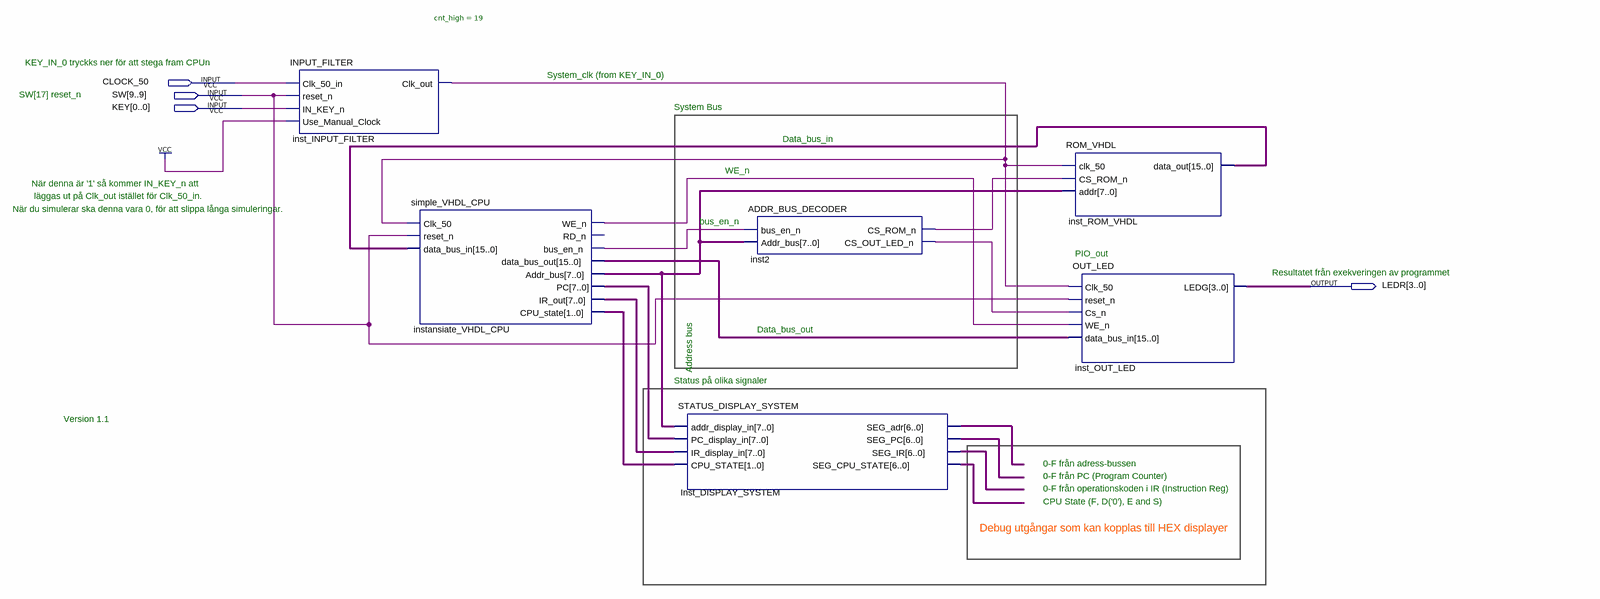
[diagram p0: schematic sheet]
// Quartus schematic CPU_VHDL_projekt.bdf as structural Verilog: 6 symbols, 4 pins
module CPU_VHDL_projekt (
  input  CLOCK_50,
  input  [9:9] SW,
  input  [0:0] KEY,
  output [3:0] LEDR
);

  wire inst2_cs_out_led_n, inst2_cs_rom_n, inst_INPUT_FILTER_clk_out, instansiate_VHDL_CPU_bus_en_n,
       instansiate_VHDL_CPU_we_n;
  wire [1:0] instansiate_VHDL_CPU_cpu_state;
  wire [6:0] Inst_DISPLAY_SYSTEM_seg_adr, Inst_DISPLAY_SYSTEM_seg_cpu_state, Inst_DISPLAY_SYSTEM_seg_ir,
       Inst_DISPLAY_SYSTEM_seg_pc;
  wire [7:0] instansiate_VHDL_CPU_addr_bus, instansiate_VHDL_CPU_ir_out, instansiate_VHDL_CPU_pc;
  wire [15:0] inst_ROM_VHDL_data_out, instansiate_VHDL_CPU_data_bus_out;

  INPUT_FILTER #(.cnt_high(19)) inst_INPUT_FILTER (
    .Clk_50_in(CLOCK_50), .reset_n(SW[9]), .IN_KEY_n(KEY[0]), .Use_Manual_Clock(1'b1),
    .Clk_out(inst_INPUT_FILTER_clk_out));
  simple_VHDL_CPU instansiate_VHDL_CPU (
    .Clk_50(inst_INPUT_FILTER_clk_out), .reset_n(SW[9]), .data_bus_in(inst_ROM_VHDL_data_out),
    .WE_n(instansiate_VHDL_CPU_we_n), .bus_en_n(instansiate_VHDL_CPU_bus_en_n),
    .data_bus_out(instansiate_VHDL_CPU_data_bus_out), .Addr_bus(instansiate_VHDL_CPU_addr_bus),
    .IR_out(instansiate_VHDL_CPU_ir_out), .CPU_state(instansiate_VHDL_CPU_cpu_state),
    .PC(instansiate_VHDL_CPU_pc));  // open: RD_n
  STATUS_DISPLAY_SYSTEM Inst_DISPLAY_SYSTEM (
    .addr_display_in(instansiate_VHDL_CPU_addr_bus), .PC_display_in(instansiate_VHDL_CPU_pc),
    .IR_display_in(instansiate_VHDL_CPU_ir_out), .CPU_STATE(instansiate_VHDL_CPU_cpu_state),
    .SEG_adr(Inst_DISPLAY_SYSTEM_seg_adr), .SEG_PC(Inst_DISPLAY_SYSTEM_seg_pc),
    .SEG_IR(Inst_DISPLAY_SYSTEM_seg_ir), .SEG_CPU_STATE(Inst_DISPLAY_SYSTEM_seg_cpu_state));
  ADDR_BUS_DECODER inst2 (
    .bus_en_n(instansiate_VHDL_CPU_bus_en_n), .Addr_bus(instansiate_VHDL_CPU_addr_bus),
    .CS_ROM_n(inst2_cs_rom_n), .CS_OUT_LED_n(inst2_cs_out_led_n));
  ROM_VHDL inst_ROM_VHDL (
    .clk_50(inst_INPUT_FILTER_clk_out), .CS_ROM_n(inst2_cs_rom_n), .addr(instansiate_VHDL_CPU_addr_bus),
    .data_out(inst_ROM_VHDL_data_out));
  OUT_LED inst_OUT_LED (
    .Clk_50(inst_INPUT_FILTER_clk_out), .reset_n(SW[9]), .Cs_n(inst2_cs_out_led_n),
    .WE_n(instansiate_VHDL_CPU_we_n), .data_bus_in(instansiate_VHDL_CPU_data_bus_out), .LEDG(LEDR));

  // Notes on the sheet:
  //   KEY_IN_0 tryckks ner för att stega fram CPUn
  //   System_clk (from KEY_IN_0)
  //   SW[17] reset_n
  //   System Bus
  //   Data_bus_in
  //   WE_n
  //   När denna är '1' så kommer IN_KEY_n att
  //    läggas ut på Clk_out istället för Clk_50_in.
  //   När du simulerar ska denna vara 0, för att slippa långa simuleringar.
  //   bus_en_n
  //   PIO_out
  //   Resultatet från exekveringen av programmet
  //   Address bus
  //   Data_bus_out
  //   Status på olika signaler
  //   Version 1.1
  //   0-F från adress-bussen
  //   0-F från PC (Program Counter)
  //   0-F från operationskoden i IR (Instruction Reg)
  //   CPU State (F, D('0'), E and S)
  //   Debug utgångar som kan kopplas till HEX displayer
endmodule
